# EAGLE design interstage_B2v2 (EAGLE 9.2.2)
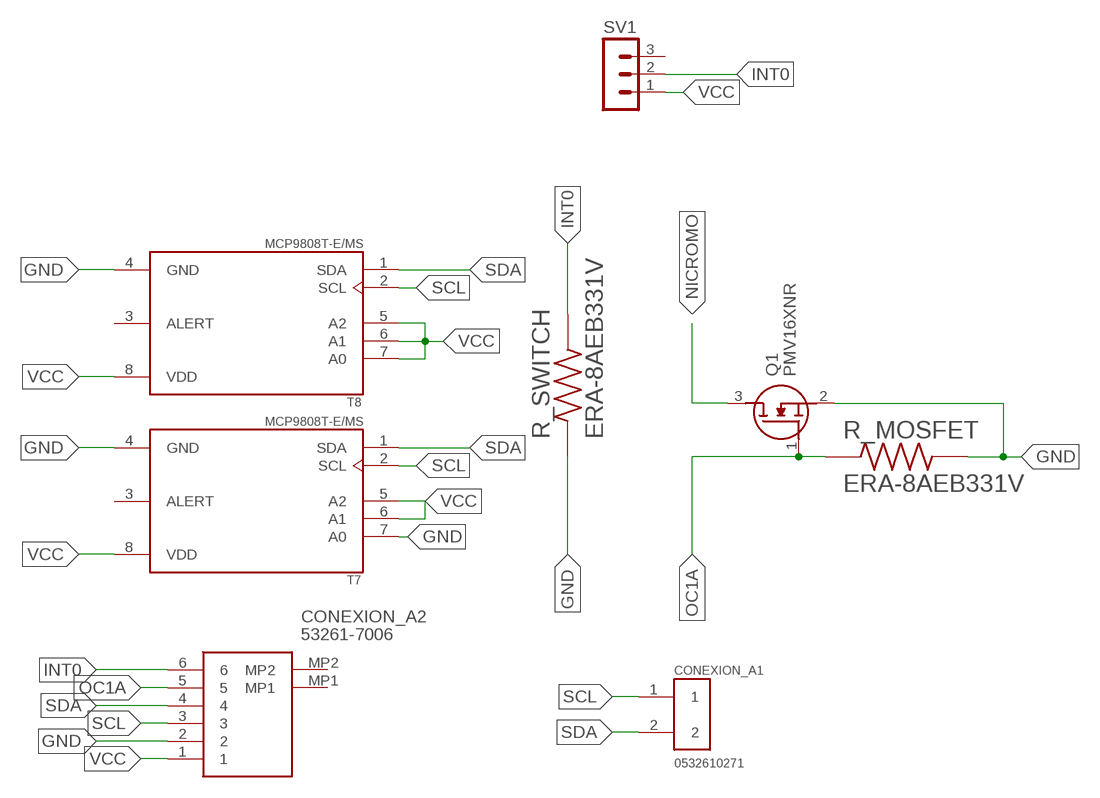
[diagram p0: schematic, sheet 1]

## Parts
CONEXION_A1  0532610271  [MOLEX_0532610271]
CONEXION_A2  53261-7006  [532617006]
Q1  PMV16XNR  [SOT95P230X110-3N]
R_MOSFET  ERA-8AEB331V  [RESC3216X70N]
R_SWITCH  ERA-8AEB331V  [RESC3216X70N]
SV1  MA03-1  [MA03-1]
T7  MCP9808T-E/MS  [SOP65P490X110-8N]
T8  MCP9808T-E/MS  [SOP65P490X110-8N]

## Nets
GND: CONEXION_A2.2 Q1.2(S) R_MOSFET.2 R_SWITCH.1 T7.4(GND) T7.7(A0) T8.4(GND)
INT0: CONEXION_A2.6 R_SWITCH.2 SV1.2
NICROMO: Q1.3(D)
OC1A: CONEXION_A2.5 Q1.1(G) R_MOSFET.1
SCL: CONEXION_A1.1 CONEXION_A2.3 T7.2(SCL) T8.2(SCL)
SDA: CONEXION_A1.2 CONEXION_A2.4 T7.1(SDA) T8.1(SDA)
VCC: CONEXION_A2.1 SV1.1 T7.5(A2) T7.6(A1) T7.8(VDD) T8.5(A2) T8.6(A1) T8.7(A0) T8.8(VDD)
Unconnected: CONEXION_A2.MP1 CONEXION_A2.MP2 SV1.3 T7.3(ALERT) T8.3(ALERT)

## Library data of the parts
CONEXION_A1 = picoblade2:0532610271: 1.25mm (.049") Pitch PicoBlade Header, Surface Mount, Right Angle, Lead-free, 2 Circuits; AVAILABILITY: Unavailable; DESCRIPTION: Picoblade Connector, 2 Circuit Single Row, Right Angle Surface Mount SMT PCB; DIGIKEY-PURCHASE-URL: https://snapeda.com/shop?store=DigiKey&id=4477935; MF: Molex; MP: 0532610271; PACKAGE: None; PRICE: None
CONEXION_A2 = SamacSys_Parts:53261-7006: 1.25mm Pitch, PicoBlade PCB Header, Single Row, Right-Angle, Surface Mount, Gold (Au) Plating, Friction Lock, Circuits, Tape and Reel Source: Datasheet <https://componentsearchengine.com/Datasheets/1/53261-7006.pdf>; DESCRIPTION: 1.25mm Pitch, PicoBlade PCB Header, Single Row, Right-Angle, Surface Mount, Gold (Au) Plating, Friction Lock, Circuits, Tape and Reel; HEIGHT: 3.6mm; MANUFACTURER_NAME: Molex; MANUFACTURER_PART_NUMBER: 53261-7006; MOUSER_PART_NUMBER: 538-53261-7006; MOUSER_PRICE-STOCK: https://www.mouser.co.uk/ProductDetail/Molex/53261-7006?qs=0lSvoLzn4L%2FSBef0BTU2GA%3D%3D
Q1 = SamacSys_Parts:PMV16XNR: Nexperia PMV16XNR N-channel MOSFET, 8.6 A, 20 V PMV16XN, 3-Pin SOT-23 Source: Datasheet <https://componentsearchengine.com/Datasheets/1/PMV16XNR.pdf>; DESCRIPTION: Nexperia PMV16XNR N-channel MOSFET, 8.6 A, 20 V PMV16XN, 3-Pin SOT-23; HEIGHT: 1.1mm; MANUFACTURER_NAME: Nexperia; MANUFACTURER_PART_NUMBER: PMV16XNR; MOUSER_PART_NUMBER: 771-PMV16XNR; MOUSER_PRICE-STOCK: https://www.mouser.com/Search/Refine.aspx?Keyword=771-PMV16XNR
R_MOSFET R_SWITCH = resistor_330_smd:ERA-8AEB331V; DESCRIPTION: 330 Ohms ±0.1% 0.25W, 1/4W Chip Resistor 1206 (3216 Metric) Automotive AEC-Q200 Thin Film; DIGI-KEY_PART_NUMBER: P330BCCT-ND; MF: Panasonic Electronic; MP: ERA-8AEB331V; PACKAGE: 3216 Panasonic Electronic Components
SV1 = con-lstb:MA03-1: PIN HEADER; OC_FARNELL: unknown; OC_NEWARK: unknown
T7 T8 = sensorSPEL:MCP9808T-E/MS: Board Mount Temperature Sensors Silicon temp sensor with I2C interface; DESCRIPTION: Temperature Sensor Digital, Local -40°C ~ 125°C 10 b 8-MSOP; DIGI-KEY_PART_NUMBER: MCP9808T-E/MSCT-ND; MF: Microchip; MP: MCP9808T-E/MS; PACKAGE: MSOP-8 Microchip

## Board
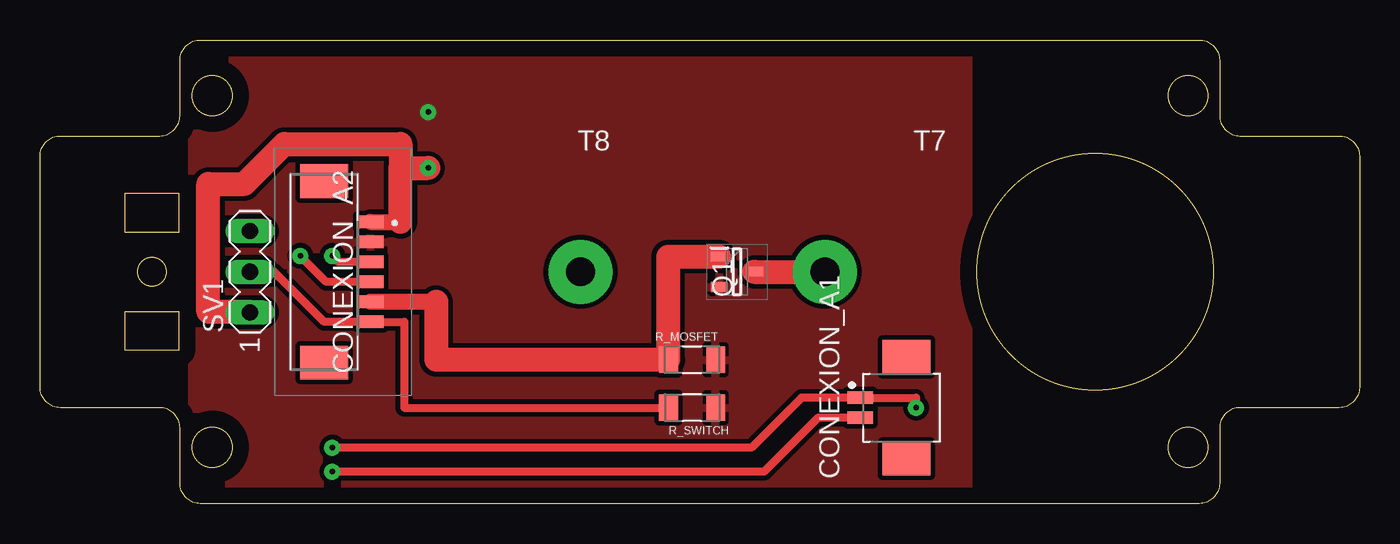
[diagram p1: board, top side]
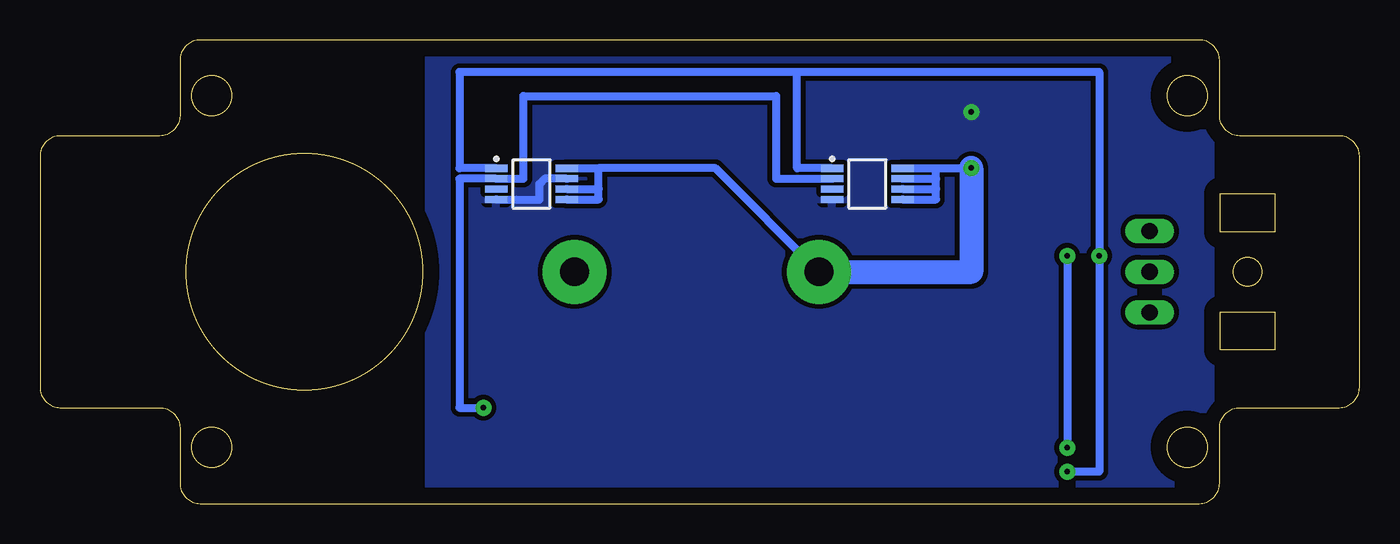
[diagram p2: board, bottom side, seen from below]

Size 82.5 x 29 mm. Coordinates in mm from the lower left corner, seen from the top.
Outline: 8.7,17 8.7,19.4 5.3,19.4 5.3,17 8.7,17
Outline: 8.7,9.6 8.7,12 5.3,12 5.3,9.6 8.7,9.6
Outline: 82.5,21.73 82.5,7.27 arc-90 81.23,6 75.02,6 arc90 73.75,4.73 73.75,1.27 arc-90 72.48,0 10.02,0 arc-90 8.75,1.27 8.75,4.73 arc90 7.48,6 1.27,6 arc-90 0,7.27 0,21.73 arc-90 1.27,23 7.48,23 arc90 8.75,24.27 8.75,27.73 arc-90 10.02,29 72.48,29 arc-90 73.75,27.73 73.75,24.27 arc90 75.02,23 81.23,23 arc-90 82.5,21.73
Outline: circle at 7,14.5 radius 0.9
Outline: circle at 65.97,14.5 radius 7.4
Outline: circle at 71.78,3.52 radius 1.25
Outline: circle at 10.77,25.52 radius 1.25
Outline: circle at 10.77,3.52 radius 1.25
Outline: circle at 71.78,25.52 radius 1.25
Copper layers (1*16): Top 0.035mm / dielectric 1.5mm / Bottom 0.035mm
Design rules "default *": minimum track width 6mil, minimum drill 0.35mm, track to track 0.3mm, track to pad 6mil, pad to pad 6mil, via to via 6mil, smd to smd 6mil, copper to edge 40mil, drill to drill 6mil, minimum pad ring 10mil, minimum via ring 8mil, stop-mask expansion 4mil, vias tented up to drill 0mil, thermal gap 10mil

### Footprints (pad centres in the part's own frame; a part is rotated, then mirrored left to right if it is on the bottom)
MOLEX_0532610271 = smd 0.8 x 1.6: 1 0.625,0; 2 -0.625,0 | smd 2.1 x 3: 3 -3.175,-2.9; 4 3.175,-2.9
532617006 = smd 0.8 x 1.6: 1 3.125,-2.5; 2 1.875,-2.5; 3 0.625,-2.5; 4 -0.625,-2.5; 5 -1.875,-2.5; 6 -3.125,-2.5 | smd 2.1 x 3: MP1 5.675,0.4; MP2 -5.675,0.4
SOT95P230X110-3N = smd 1.05 x 0.6: 1 -1.1,0.95; 2 -1.1,-0.95; 3 1.1,0
RESC3216X70N = smd 1.16 x 1.68: 1 -1.475,0; 2 1.475,0
MA03-1 = drill 1.016 long: 1 -2.54,0; 2 0,0; 3 2.54,0
SOP65P490X110-8N = smd 1.4 x 0.45: 1 -2.2,0.975; 2 -2.2,0.325; 3 -2.2,-0.325; 4 -2.2,-0.975; 5 2.2,-0.975; 6 2.2,-0.325; 7 2.2,0.325; 8 2.2,0.975

### Placement (x,y rotation side)
CONEXION_A1  51.27,6 90 top
CONEXION_A2  18.17,14.5 90 top
Q1  43.57,14.5 0 top
R_MOSFET  40.77,9 0 top
R_SWITCH  40.77,6 180 top
SV1  13.12,14.5 90 top
T7  51.77,20 0 bottom
T8  30.77,20 0 bottom

### Tracks (layer width: path | path; a pad name or v marks a point on that pad's centre or on a via)
GND  (via drill 0.35 pad 1)
  Bottom 0.5: T7.7 50.94,20.32 51.27,20 51.27,19 51.3,19.02 T7.4
  other vias: 24.27,24.5
  pour Top: 9.47,28 9.47,0.6 58.07,0.6 58.07,28.1 57.97,28
  pour Bottom: 9.32,28 9.32,0.4 58.17,0.4 58.17,28
INT0
  Top 0.5: SV1.2 14.64,14.5 17.77,11.38 CONEXION_A2.6 22.77,11.38 22.77,6 R_SWITCH.2
NICROMO  (via drill 1.8 pad 4)
  Top 1.5: Q1.3 v49.07,14.5
OC1A
  Top 0.5: R_MOSFET.1 39.27,9.03
  Top 1: 24.77,12.62 CONEXION_A2.5
  Top 1.5: Q1.1 39.27,15.45 39.27,9.03 | 24.77,12.62 24.77,9 R_MOSFET.1
SCL  (via drill 0.35 pad 1)
  Top 0.5: v54.77,6 54.77,6.62 CONEXION_A1.1 47.59,6.62 44.47,3.5 v18.27,3.5 | CONEXION_A2.3 18.64,15.12 v18.27,15.5
  Bottom 0.5: T8.2 36.47,20.32 36.47,25.5 52.27,25.5 52.27,20.32 T7.2 56.27,20.32 56.27,6 v54.77,6 | v18.27,15.5 v18.27,3.5
SDA  (via drill 0.35 pad 1)
  Top 0.5: CONEXION_A1.2 48.64,5.38 45.27,2 v18.27,2 | CONEXION_A2.4 17.89,13.88 v16.27,15.5
  Bottom 0.5: T8.1 35.17,20.98 35.17,27 | T7.1 56.27,20.98 56.27,27 35.17,27 | 35.17,27 16.27,27 v16.27,15.5 16.27,2 v18.27,2
VCC  (via drill 0.35 pad 1, 1.8 pad 4)
  Top 0.5: SV1.1 13.08,12
  Top 1: CONEXION_A2.1 22.55,17.62
  Top 1.5: 22.55,17.62 22.55,21 | 22.55,21 v24.27,21 | 13.08,12 10.52,12 10.52,20 12.77,20 15.27,22.5 22.55,22.5 22.55,21
  Bottom 0.5: T8.8 26.47,20.98 | T7.8 47.57,20.98 | T8.7 26.47,20.32 | 26.47,20.32 26.47,20.98 | T8.6 26.47,19.68 | 26.47,19.68 26.47,20.32 | T8.5 26.47,19.02 26.47,19.68 | T7.6 47.57,19.68 | 47.57,19.68 47.57,20.98 | T7.5 47.57,19.02 47.57,19.68 | 26.47,20.98 24.27,20.98 v24.27,21 | v33.8,14.5 40.27,20.98 47.57,20.98
  Bottom 1.5: v24.27,21 24.27,14.5 v33.8,14.5